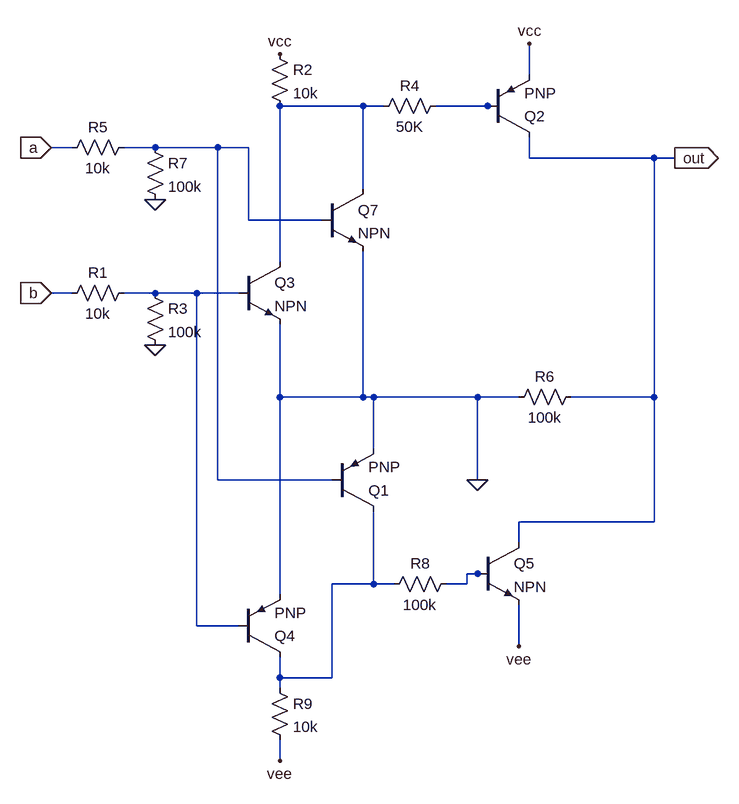
[diagram p0: schematic TOR.asc]
TOR.asc, the LTspice schematic file:
Version 4
SHEET 1 1456 780
WIRE -160 -928 -160 -976
WIRE -416 -880 -544 -880
WIRE -384 -880 -416 -880
WIRE -224 -880 -304 -880
WIRE -208 -880 -224 -880
WIRE -864 -816 -896 -816
WIRE -736 -816 -784 -816
WIRE -640 -816 -736 -816
WIRE -592 -816 -640 -816
WIRE -160 -800 -160 -832
WIRE 32 -800 -160 -800
WIRE 64 -800 32 -800
WIRE -416 -752 -416 -880
WIRE -592 -704 -592 -816
WIRE -480 -704 -592 -704
WIRE -544 -640 -544 -880
WIRE -864 -592 -896 -592
WIRE -736 -592 -784 -592
WIRE -672 -592 -736 -592
WIRE -608 -592 -672 -592
WIRE -544 -432 -544 -544
WIRE -416 -432 -416 -656
WIRE -416 -432 -544 -432
WIRE -400 -432 -416 -432
WIRE -240 -432 -400 -432
WIRE -176 -432 -240 -432
WIRE 32 -432 32 -800
WIRE 32 -432 -96 -432
WIRE -400 -352 -400 -432
WIRE -640 -304 -640 -816
WIRE -464 -304 -640 -304
WIRE -240 -304 -240 -432
WIRE 32 -240 32 -432
WIRE 32 -240 -176 -240
WIRE -176 -208 -176 -240
WIRE -240 -160 -256 -160
WIRE -224 -160 -240 -160
WIRE -400 -144 -400 -256
WIRE -400 -144 -464 -144
WIRE -368 -144 -400 -144
WIRE -256 -144 -256 -160
WIRE -256 -144 -288 -144
WIRE -544 -128 -544 -432
WIRE -672 -80 -672 -592
WIRE -608 -80 -672 -80
WIRE -176 -48 -176 -112
WIRE -544 0 -544 -32
WIRE -464 0 -464 -144
WIRE -464 0 -544 0
WIRE -544 16 -544 0
WIRE -544 128 -544 96
FLAG 64 -800 out
IOPIN 64 -800 Out
FLAG -544 -960 vcc
FLAG -160 -976 vcc
FLAG -896 -816 a
IOPIN -896 -816 In
FLAG -736 -736 0
FLAG -896 -592 b
IOPIN -896 -592 In
FLAG -736 -512 0
FLAG -544 128 vee
FLAG -176 -48 vee
FLAG -240 -304 0
SYMBOL Res -560 -976 R0
SYMATTR InstName R2
SYMATTR Value 10k
SYMBOL Res -288 -896 R90
WINDOW 0 0 56 VBottom 2
WINDOW 3 32 56 VTop 2
SYMATTR InstName R4
SYMATTR Value 50K
SYMBOL pnp -224 -832 M180
SYMATTR InstName Q2
SYMBOL Res -768 -832 R90
WINDOW 0 0 56 VBottom 2
WINDOW 3 32 56 VTop 2
SYMATTR InstName R5
SYMATTR Value 10k
SYMBOL Res -752 -832 R0
SYMATTR InstName R7
SYMATTR Value 100k
SYMBOL Res -768 -608 R90
WINDOW 0 0 56 VBottom 2
WINDOW 3 32 56 VTop 2
SYMATTR InstName R1
SYMATTR Value 10k
SYMBOL Res -752 -608 R0
SYMATTR InstName R3
SYMATTR Value 100k
SYMBOL npn -608 -640 R0
SYMATTR InstName Q3
SYMBOL Res -272 -160 R90
WINDOW 0 0 56 VBottom 2
WINDOW 3 32 56 VTop 2
SYMATTR InstName R8
SYMATTR Value 100k
SYMBOL Res -560 0 R0
SYMATTR InstName R9
SYMATTR Value 10k
SYMBOL pnp -608 -32 M180
SYMATTR InstName Q4
SYMBOL npn -240 -208 R0
SYMATTR InstName Q5
SYMBOL Res -80 -448 R90
WINDOW 0 0 56 VBottom 2
WINDOW 3 32 56 VTop 2
SYMATTR InstName R6
SYMATTR Value 100k
SYMBOL npn -480 -752 R0
SYMATTR InstName Q7
SYMBOL pnp -464 -256 M180
SYMATTR InstName Q1

The netlist it stands for:
* TOR.asc
R2 vcc N001 10k
R4 N002 N001 50K
Q2 out N002 vcc 0 PNP
R5 N003 a 10k
R7 N003 0 100k
R1 N004 b 10k
R3 N004 0 100k
Q3 N001 N004 0 0 NPN
R8 N005 N006 100k
R9 N006 vee 10k
Q4 N006 N004 0 0 PNP
Q5 out N005 vee 0 NPN
R6 out 0 100k
Q7 N001 N003 0 0 NPN
Q1 N006 N003 0 0 PNP
.model NPN NPN
.model PNP PNP
.lib standard.bjt
.backanno
.end